# EAGLE design AutoFeatherPower2 (EAGLE 9.4.0)
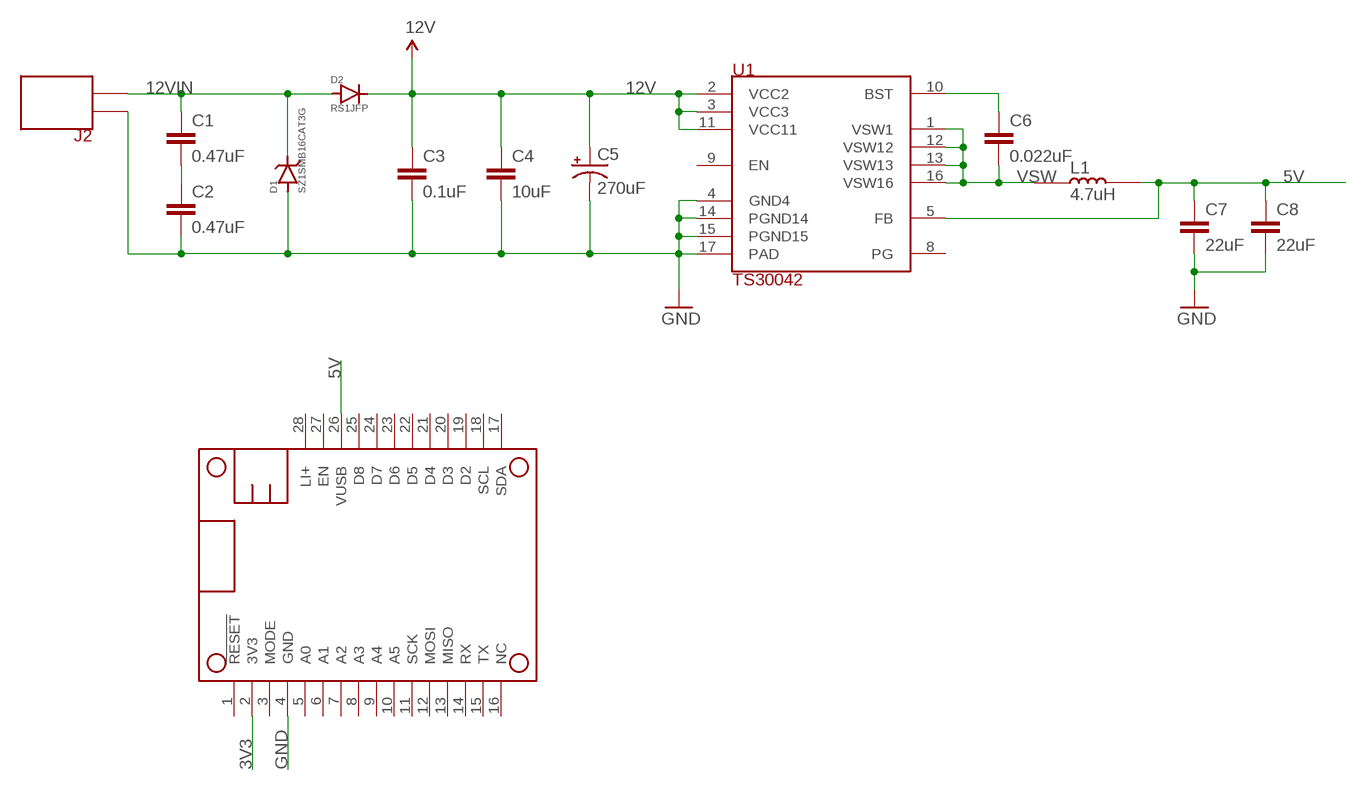
[diagram p0: schematic, sheet 1]

## Parts
C1  0.47uF  CAP-0.47UF-0805  [0805]
C2  0.47uF  CAP-0.47UF-0805  [0805]
C3  0.1uF  CAP-0.1UF-0603  [0603-CAP]
C4  10uF  CAP-10UF-0603  [0603-CAP]
C5  270uF  CAP-270UF-35V-SMD  [CAP-PANASONIC-FKS-V-F]
C6  0.022uF  CAP-0.022UF-0603  [0603-CAP]
C7  22uF  CAP-22UF-0805  [0805]
C8  22uF  CAP-22UF-0805  [0805]
D1  SZ1SMB16CAT3G  DIODE-TVS-SZ1SMB  [SZ1SMB]
D2  RS1JFP  DIODE-RS1JFP  [SOD-123HE-ON]
J2  TERMBLOCK-2X3.5MM  [TERMBLOCK-2X3.5MM]
L1  4.7uH  INDUCTOR-4.7UH-3A  [WURTH-744774047]
MS1  FEATHERWING_NODIM  [FEATHERWING_NODIM]
U1  TS30042  REG-TS30011  [REG-TS30011]

## Nets
3V3: MS1.2(3V3)
5V: C7.1 C8.1 L1.2 MS1.26(VUSB) U1.5(FB)
12V: C3.1 C4.1 C5.P+(+) D2.1(CATHODE) U1.2(VCC2) U1.3(VCC3) U1.11(VCC11)
12VIN: C1.1 D1.C(CATHODE) D2.2(ANODE) J2.2
BST: C6.1 U1.10(BST)
GND: C2.2 C3.2 C4.2 C5.P-(-) C7.2 C8.2 D1.A(ANODE) J2.1 MS1.4(GND) U1.4(GND4) U1.14(PGND14) U1.15(PGND15) U1.17(PAD)
N$3: C1.2 C2.1
VSW: C6.2 L1.1 U1.1(VSW1) U1.12(VSW12) U1.13(VSW13) U1.16(VSW16)
Unconnected: MS1.1(!RESET) MS1.3(MODE) MS1.5(A0) MS1.6(A1) MS1.7(A2) MS1.8(A3) MS1.9(A4) MS1.10(A5) MS1.11(SCK) MS1.12(MOSI) MS1.13(MISO) MS1.14(RX) MS1.15(TX) MS1.16(NC) MS1.17(SDA) MS1.18(SCL) MS1.19(D2) MS1.20(D3) MS1.21(D4) MS1.22(D5) MS1.23(D6) MS1.24(D7) MS1.25(D8) MS1.27(EN) MS1.28(LI+) U1.8(PG) U1.9(EN)

## Library data of the parts
C1 C2 = rickk2:CAP-0.47UF-0805: Wurth Electronics Inc. 885012207076 CAP CER 0.47UF 25V X7R 0805 0.47µF ±10% 25V Ceramic Capacitor X7R 0805 (2012 Metric) https://www.digikey.com/product-detail/en/wurth-electronics-inc/885012207076/732-7670-1-ND/5454297 Ordered 20 2019-04-01
C3 = rickk2:CAP-0.1UF-0603: CAP CER 0.1UF 16V X7R 0603 https://www.digikey.com/product-detail/en/murata-electronics-north-america/GRM188R71C104KA01D/490-1532-1-ND/587771
C4 = rickk2:CAP-10UF-0603: CAP CER 10UF 16V X5R 0805 $ 0.21 https://www.digikey.com/product-detail/en/murata-electronics-north-america/GRM21BR61C106KE15L/490-3886-1-ND/965928
C5 = rickk2:CAP-270UF-35V-SMD: CAP 270uF 35V SMD 8mm dia x 10.5mm height Panasonic Electronic Components EEE-FK1V271SP $0.84 CAP ALUM 270UF 20% 35V SMD 270µF 35V Aluminum Electrolytic Capacitors Radial, Can - SMD 160 mohm @ 100kHz 2000 Hrs @ 105°C https://www.digikey.com/product-detail/en/panasonic-electronic-components/EEE-FK1V271SP/P18962CT-ND/5805069 Series: FVS Type: V Size Code: F
C6 = rickk2:CAP-0.022UF-0603: KEMET C0603C223K5RACTU $0.10 CAP CER 0.022UF (22nF) 50V X7R 0603 0.022µF ±10% 50V Ceramic Capacitor X7R 0603 (1608 Metric) https://www.digikey.com/product-detail/en/kemet/C0603C223K5RACTU/399-1280-1-ND/416056 Ordered 100 2019-04-01
C7 C8 = rickk2:CAP-22UF-0805: 22 uF capacitor 6.3V 0805 $ .314 https://www.digikey.com/product-detail/en/murata-electronics-north-america/GRM219R61A226MEA0D/490-9951-1-ND/5026414 Ordered 10 2019-04-01
D1 = rickk2:DIODE-TVS-SZ1SMB: Littelfuse Inc. SZ1SMB16CAT3G $0.97 **not purchased yet** TVS DIODE 16V 26V SMB 26V Clamp 23.1A Ipp Tvs Diode Surface Mount SMB https://www.digikey.com/products/en/circuit-protection/tvs-diodes/144?k=1SMB16CAT3G&k=&pkeyword=1SMB16CAT3G&sv=0&pv7=2&pv1989=0&sf=0&quantity=&ColumnSort=0&page=1&stock=1&pageSize=25 Unidirectional. Marking: LM Marking band on cathode side Device: DIODE-TVS-SZ1SMB
D2 = rickk2:DIODE-RS1JFP: Reverse voltage protection diode - not ordered yet! ON Semiconductor RS1JFP $0.44 DIODE GP 600V 1.2A SOD123HE Diode Standard 600V 1.2A Surface Mount SOD-123HE https://www.digikey.com/product-detail/en/on-semiconductor/RS1JFP/RS1JFPCT-ND/5722970 Used in Ford open power supply 1=Cathode=Large Pad=side with band 2=Anode=Small Pad
J2 = rickk2:TERMBLOCK-2X3.5MM
L1 = rickk2:INDUCTOR-4.7UH-3A: Wurth Electronics Inc. 744774047 $1.78 FIXED IND 4.7UH 3A 71 MOHM SMD 4.7µH Unshielded Wirewound Inductor 3A 71mOhm Max Nonstandard https://www.digikey.com/product-detail/en/wurth-electronics-inc/744774047/732-1266-1-ND/1639327
MS1 = Particle-Mesh:FEATHERWING
U1 = rickk2:REG-TS30011: Switching Reg 5V out, 2A, 40V max in Semtech Corporation TS30042-M050QFNR $1.64 IC REG BUCK 5V 2A 16QFN Buck Switching Regulator IC Positive Fixed 5V 1 Output 2A 16-VFQFN Exposed Pad https://www.digikey.com/product-detail/en/semtech-corporation/TS30042-M050QFNR/TS30042-M050QFNRCT-ND/6605537 Voltage In Min 4.5V Max 40V Input caps: 10 uF 35V 0.1uF (optional) Cbst 22nF Lout 4.7 uH (3A) Cout1 22 uF Cout2 22 uF

## Board
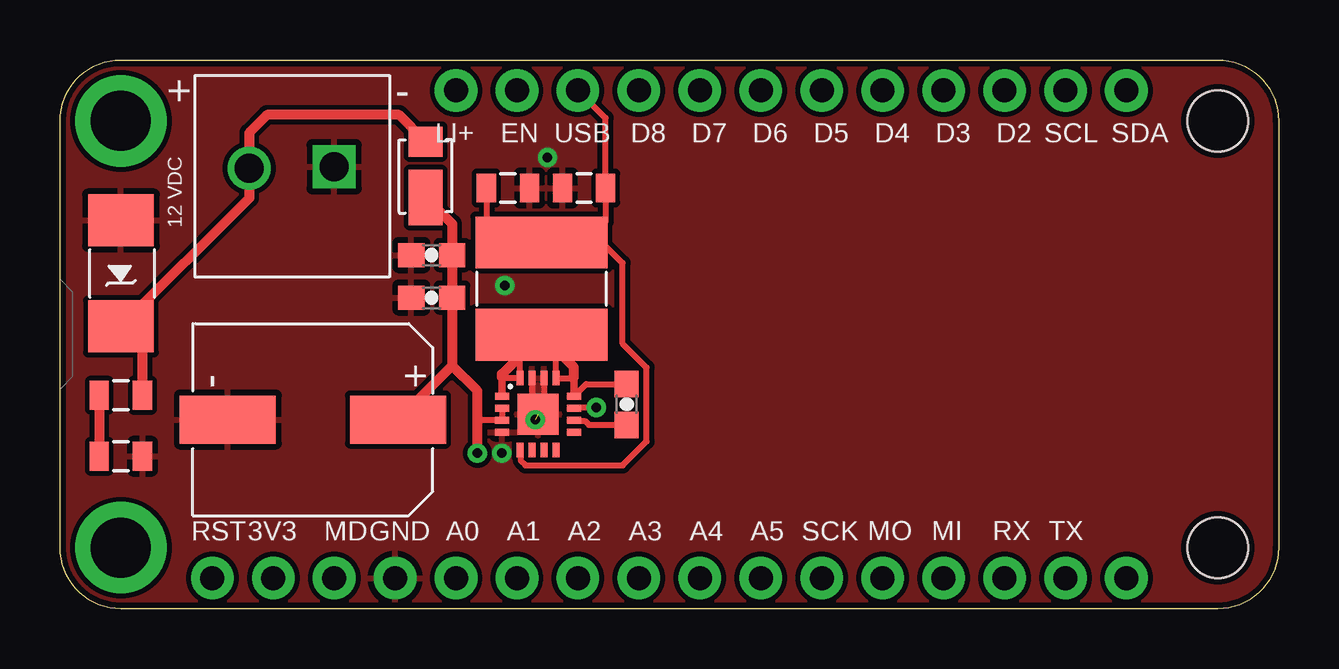
[diagram p1: board, top side]
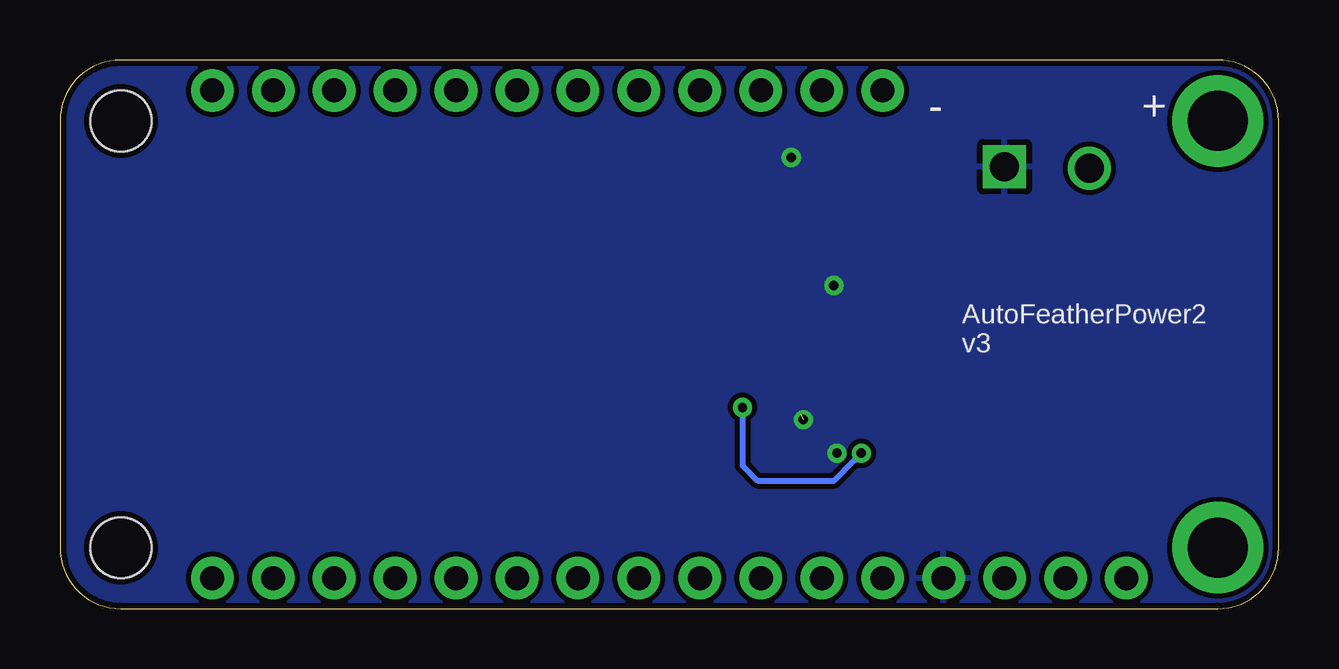
[diagram p2: board, bottom side, seen from below]

Size 50.8 x 22.86 mm. Coordinates in mm from the lower left corner, seen from the top.
Outline: 2.54,22.86 48.26,22.86 arc-90 50.8,20.32 50.8,2.54 arc-90 48.26,0 2.54,0 arc-90 0,2.54 0,20.32 arc-90 2.54,22.86
Copper layers (1*16): Top 0.035mm / dielectric 1.5mm / Bottom 0.035mm
Design rules "adafruit": minimum track width 8mil, minimum drill 15.5mil, track to track 8mil, track to pad 8mil, pad to pad 8mil, via to via 8mil, smd to smd 8mil, copper to edge 10mil, drill to drill 8mil, minimum pad ring 10mil, minimum via ring 8mil, stop-mask expansion 2mil, vias tented up to drill 20mil, thermal gap 10mil

### Footprints (pad centres in the part's own frame; a part is rotated, then mirrored left to right if it is on the bottom)
0805 = smd 0.8 x 1.2: 1 -0.9,0; 2 0.9,0
0603-CAP = smd 1.1 x 1: 1 -0.85,0; 2 0.85,0
CAP-PANASONIC-FKS-V-F = smd 2 x 4: P+ 0,-3.55; P- 0,3.55
SZ1SMB = smd 2.159 x 2.743: A 2.21,0; C -2.21,0
SOD-123HE-ON = smd 2.3 x 1.4: 1 -0.9,0 | smd 1.25 x 1.4: 2 1.425,0
TERMBLOCK-2X3.5MM = drill 1.2 square: 1 0,0 | drill 1.2: 2 3.54,0.07
WURTH-744774047 = smd 5.5 x 2.15: 1 0,1.925; 2 0,-1.925
FEATHERWING_NODIM = drill 1 pad 1.778: 1 6.35,1.27; 2 8.89,1.27; 3 11.43,1.27; 4 13.97,1.27; 5 16.51,1.27; 6 19.05,1.27; 7 21.59,1.27; 8 24.13,1.27; 9 26.67,1.27; 10 29.21,1.27; 11 31.75,1.27; 12 34.29,1.27; 13 36.83,1.27; 14 39.37,1.27; 15 41.91,1.27; 16 44.45,1.27; 17 44.45,21.59; 18 41.91,21.59; 19 39.37,21.59; 20 36.83,21.59; 21 34.29,21.59; 22 31.75,21.59; 23 29.21,21.59; 24 26.67,21.59; 25 24.13,21.59; 26 21.59,21.59; 27 19.05,21.59; 28 16.51,21.59 | drill 2.5 pad 3.81: P$1 2.54,20.32; P$2 2.54,2.54 | hole 2.54: 48.26,20.32; 48.26,2.54
REG-TS30011 = smd 0.6 x 0.28: 1 -0.75,2.25; 2 -0.75,1.75; 3 -0.75,1.25; 4 -0.75,0.75; 9 2.25,0.75; 10 2.25,1.25; 11 2.25,1.75; 12 2.25,2.25 | smd 0.28 x 0.6: 5 0,0; 6 0.5,0; 7 1,0; 8 1.5,0; 13 1.5,3; 14 1,3; 15 0.5,3; 16 0,3 | smd 1.7 x 1.7: 17 0.75,1.5

### Placement (x,y rotation side)
C1  2.54,8.89 180 top
C2  2.54,6.35 0 top
C3  15.49,14.73 180 top
C4  15.49,12.95 180 top
C5  10.54,7.87 90 top
C6  23.62,8.51 90 top
C7  18.67,17.53 0 top
C8  21.84,17.53 180 top
D1  2.54,13.97 90 top
D2  15.24,18.03 90 top
J2  11.43,18.41 180 top
L1  20.07,13.34 180 top
MS1  0,0 0 top
U1  19.18,6.6 0 top

### Tracks (layer width: path | path; a pad name or v marks a point on that pad's centre or on a via)
5V
  Top 0.254: U1.5 19.21,6.57 19.21,6.17 19.4,5.97 23.45,5.97 24.45,6.97 24.45,10.05 23.45,11.04 23.45,14.39 22.23,15.62 | C7.1 17.78,17.52 17.78,15.75 18.27,15.26 L1.2 21.86,15.26 22.23,15.62 | 22.23,15.62 22.74,16.14 C8.1 22.74,20.44 MS1.26
12V  (via drill 0.39)
  Top 0.254: U1.2 U1.3 17.42,7.85 17.4,7.87 | U1.11 21.45,8.38 v22.35,8.38
  Top 0.406: D2.1 16.34,16.03 C3.1 C4.1 16.34,10.13 | v17.4,6.48 17.4,7.62 17.4,7.87 17.4,9.07 16.34,10.13 | 16.34,10.13 C5.P+
  Bottom 0.254: v17.4,6.48 17.68,6.19 17.68,6.17 18.52,5.33 21.72,5.33 22.35,5.97 v22.35,8.38
12VIN
  Top 0.406: C1.1 3.44,10.86 D1.C 7.89,17.11 J2.2 7.89,19.83 8.64,20.57 14.12,20.57 D2.2
BST
  Top 0.254: U1.10 21.46,7.82 21.88,7.82 22.05,7.65 22.65,7.65 22.66,7.66 C6.1
GND  (via drill 0.39)  (1 unrouted)
  Top 0.254: U1.15 19.68,8.35 U1.17 20.18,8.35 U1.14
  other vias: 18.41,6.48 19.81,7.87 20.32,18.8 18.54,13.46
  pour Top: 0,0 0,25.4 53.34,25.4 53.34,0
  pour Bottom: 0,0 0,27.94 50.8,27.94 50.8,0
N$3
  Top 0.406: C1.2 C2.1
VSW
  Top 0.254: U1.12 21.93,9.36 C6.2 | 18.43,9.65 18.48,9.6 U1.16 19.18,10.52 L1.1 20.68,10.8 U1.13 21.38,9.6 21.43,9.65
  Top 0.305: U1.1 18.43,9.56 18.48,9.6 | U1.12 21.43,9.65
  Top 0.406: 18.43,9.65 18.43,9.77 L1.1 21.43,10.05 21.43,9.65

### Text on the board
tPlace: + | - | LI+ | EN | USB | D8 | D7 | D6 | D5 | D4 | D3 | D2 | SCL | SDA | 12 VDC | RST | 3V3 | MD | GND | A0 | A1 | A2 | A3 | A4 | A5 | SCK | MO | MI | RX | TX
bPlace: + | - | AutoFeatherPower2 / v3